# Altium schematic sheet Brake Light Schmatic.SchDoc
size A4; SheetNumber: 1; SheetTotal: 1
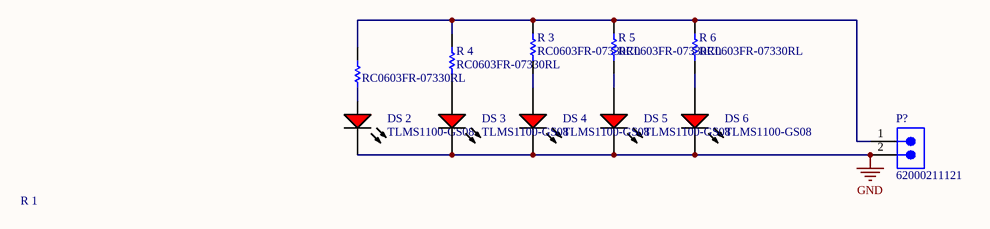
[diagram p0: Brake Light Schmatic.SchDoc]

## Parts
DS_2  TLMS1100-GS08  [VISH-TLMX1100_V]
DS_3  TLMS1100-GS08  [VISH-TLMX1100_V]
DS_4  TLMS1100-GS08  [VISH-TLMX1100_V]
DS_5  TLMS1100-GS08  [VISH-TLMX1100_V]
DS_6  TLMS1100-GS08  [VISH-TLMX1100_V]
P?  62000211121  [62000211121]
R_1  RC0603FR-07330RL  [RESC1608X55X25NL10T15]
R_3  RC0603FR-07330RL  [RESC1608X55X25NL10T15]
R_4  RC0603FR-07330RL  [RESC1608X55X25NL10T15]
R_5  RC0603FR-07330RL  [RESC1608X55X25NL10T15]
R_6  RC0603FR-07330RL  [RESC1608X55X25NL10T15]

## Nets
GND: DS_2.2(K) DS_3.2(K) DS_4.2(K) DS_5.2(K) DS_6.2(K) P?.2
NetDS_2_1: DS_2.1(A) R_1.2
NetDS_3_1: DS_3.1(A) R_4.2
NetDS_4_1: DS_4.1(A) R_3.2
NetDS_5_1: DS_5.1(A) R_5.2
NetDS_6_1: DS_6.1(A) R_6.2
NetP?_1: P?.1 R_1.1 R_3.1 R_4.1 R_5.1 R_6.1

## Library data of the parts
DS_2-DS_6 = CMP-1666-00027-1: LED, RED, 2.1 V, -40 to 100 degC, 2-Pin SMD (0603), RoHS, Tape and Reel; Type (Capacitors): C0G; Resistance: 100000000000 Ohm; Capacitance: 12 pF; Voltage Rating: 50 V; Tolerance: 5%; Min Operating Temperature: -55degC; REACH SVHC: No SVHC; ComponentLink2Description: Datasheet; ComponentLink1URL: http://www.vishay.com/; Width: 0.8 mm; Package Quantity: 4000; PackageReference: TLMX1100; ComponentLink2URL: http://www.vishay.com/docs/83173/tlmb1100.pdf; Case/Package: 0603; Case Code (Metric): 1608; Packaging: Tape and Reel; Pins: 2; ComponentLink1Description: Manufacturer URL; Max Operating Temperature: 125degC; Height: 0.8 mm; Length: 1.6 mm; Mount: Surface Mount; PackageDescription: 2-Pin Surface Mount Device, Body 1.6 x 0.8 mm; DatasheetVersion: Rev. 2.7, 03/2016; Case Code (Imperial): 0603; Voltage Rating (DC): 50 V; RoHSCompliant: True; Radiation Hardening: No
P? = CMP-1502-00956-3: NexarPartId: 61924778; Number of Contacts: 2; Voltage Rating: 200V; Gender: Male; Contact Resistance: 20mΩ; Current Rating: 2A; Lead Pitch: 2mm; Max Operating Temperature: 105°C; Contact Material: Gold; Number of Rows: 1; Operating Supply Voltage: 200V; Number of Pins: 2; Orientation: Vertical; Min Operating Temperature: -40°C; Height: 6.35mm; RoHS: Non-Compliant
R_1 R_3-R_6 = CMP-1659-00020-2: Chip Resistor, 330 Ohm, +/- 1%, 0.1 W, -55 to 155 degC, 0603 (1608 Metric), RoHS, Tape and Reel; Tolerance: 10%; ESR: 800 mohm; Voltage Rating (DC): 16 V; Capacitance: 47 uF; Length: 7.3 mm; ComponentLink1URL: http://www.yageo.com/; Packaging: Tape and Reel; Pins: 2; ComponentLink1Description: Manufacturer URL; Case Code (Imperial): 2917; REACH SVHC: No SVHC; Width: 4.3 mm; ComponentLink2Description: Datasheet; Voltage Rating: 16 V; RoHSCompliant: True; Max Operating Temperature: 125degC; ComponentLink2URL: http://www.yageo.com/documents/recent/PYu-RC_Group_51_RoHS_L_04.pdf; Min Operating Temperature: -55degC; Case/Package: 2917; Radiation Hardening: No; DatasheetVersion: Rev. 4, 02/2016; Mount: Surface Mount; PackageReference: 0603; Package Quantity: 500; Case Code (Metric): 7343; PackageDescription: 2-Pin Surface Mount Device, Body 1.6 x 0.8 mm; Height: 3.1 mm